# Altium schematic sheet bigsegment.SchDoc
size A3; SPICEModelCacheRLVYLVLF: <root> / <DocumentId>RLVYLVLF</DocumentId> / <CacheFrame Number="0"> / <Model Name="dtunnel1" Kind="CKT"> / <Text>*Tunnel Diode Default / *MCE 600V 50A 27.2ns default parameters / *Diode Pinout: A,K / * Parameters: / * RS:  Series resistance value / * RP:  Negative resistance value in parallel with capacitance. / * CP:   Capacitance value in parallel with negative resistance. / * LS:  Series inductance value. / * / * / .SUBCKT DTUNNEL1 1 2 PARAMS: Rs=6 Rp=-75 Cp=0.6E-12 Ls=0.1nH / RS  1 3  {Rs} / RP  3 4  {Rp} / CP  3 4  {Cp} / LS  4 2  {Ls} / .ENDS DTUNNEL1</Text> / </Model> / </CacheFrame> / </root>
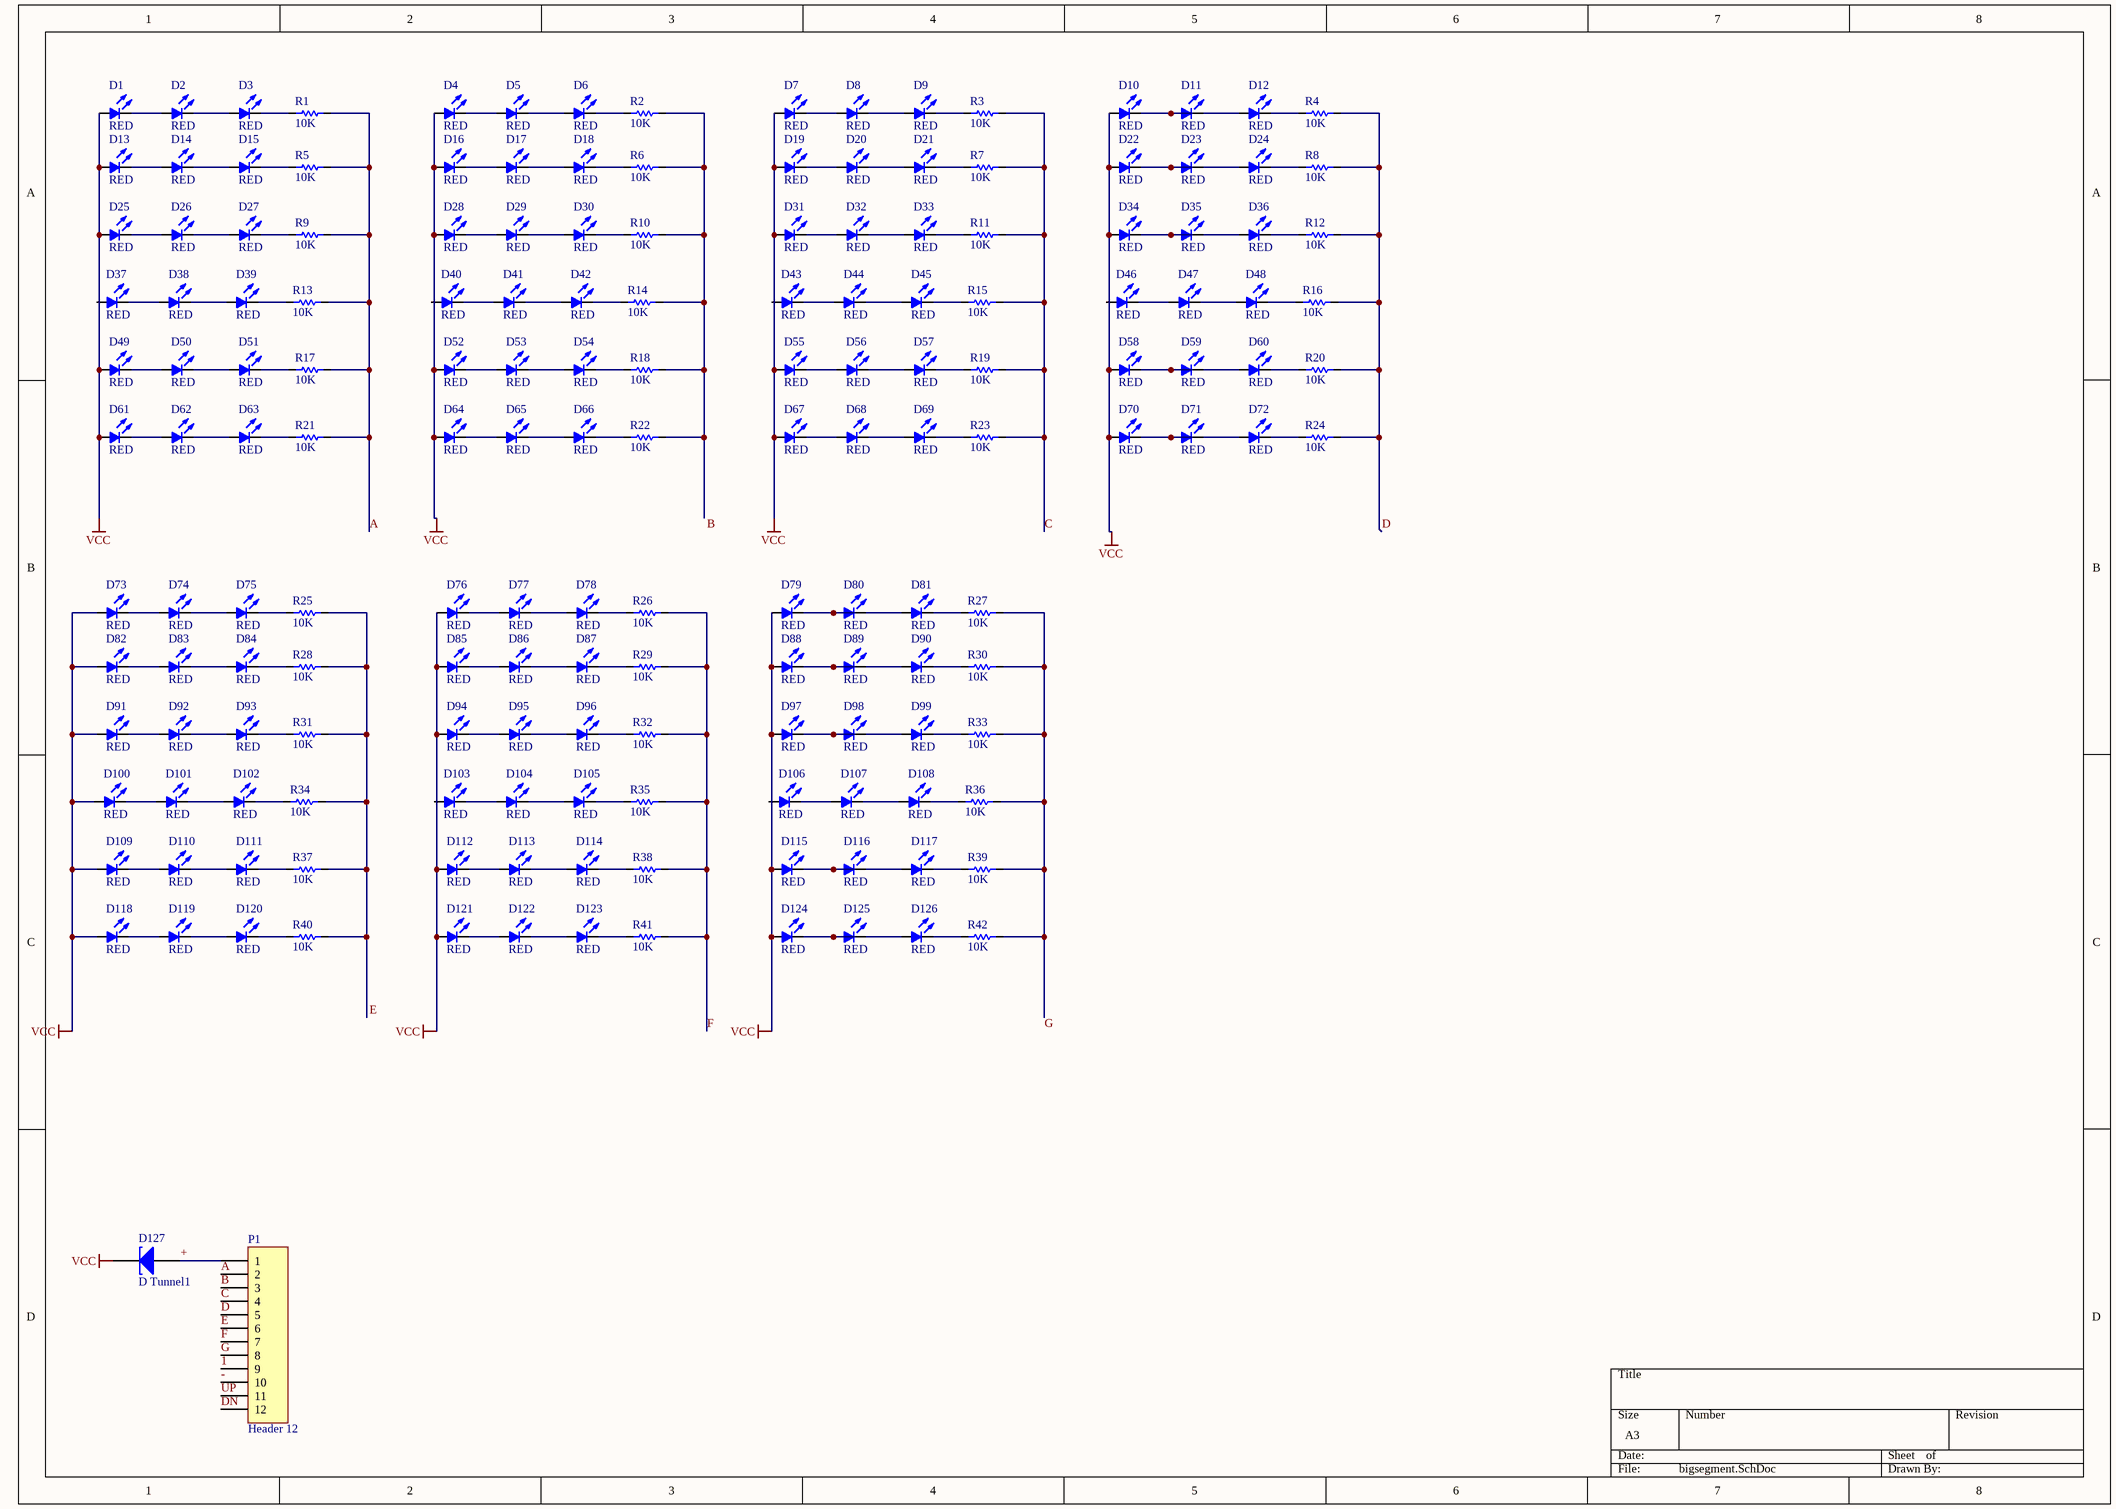
[diagram p0: bigsegment.SchDoc]

## Parts
D1  COLOR: RED  [RES 0805 (2012X06L)]  (hidden comment: MODEL)
D2  COLOR: RED  [RES 0805 (2012X06L)]  (hidden comment: MODEL)
D3  COLOR: RED  [RES 0805 (2012X06L)]  (hidden comment: MODEL)
D4  COLOR: RED  [RES 0805 (2012X06L)]  (hidden comment: MODEL)
D5  COLOR: RED  [RES 0805 (2012X06L)]  (hidden comment: MODEL)
D6  COLOR: RED  [RES 0805 (2012X06L)]  (hidden comment: MODEL)
D7  COLOR: RED  [RES 0805 (2012X06L)]  (hidden comment: MODEL)
D8  COLOR: RED  [RES 0805 (2012X06L)]  (hidden comment: MODEL)
D9  COLOR: RED  [RES 0805 (2012X06L)]  (hidden comment: MODEL)
D10  COLOR: RED  [RES 0805 (2012X06L)]  (hidden comment: MODEL)
D11  COLOR: RED  [RES 0805 (2012X06L)]  (hidden comment: MODEL)
D12  COLOR: RED  [RES 0805 (2012X06L)]  (hidden comment: MODEL)
D13  COLOR: RED  [RES 0805 (2012X06L)]  (hidden comment: MODEL)
D14  COLOR: RED  [RES 0805 (2012X06L)]  (hidden comment: MODEL)
D15  COLOR: RED  [RES 0805 (2012X06L)]  (hidden comment: MODEL)
D16  COLOR: RED  [RES 0805 (2012X06L)]  (hidden comment: MODEL)
D17  COLOR: RED  [RES 0805 (2012X06L)]  (hidden comment: MODEL)
D18  COLOR: RED  [RES 0805 (2012X06L)]  (hidden comment: MODEL)
D19  COLOR: RED  [RES 0805 (2012X06L)]  (hidden comment: MODEL)
D20  COLOR: RED  [RES 0805 (2012X06L)]  (hidden comment: MODEL)
D21  COLOR: RED  [RES 0805 (2012X06L)]  (hidden comment: MODEL)
D22  COLOR: RED  [RES 0805 (2012X06L)]  (hidden comment: MODEL)
D23  COLOR: RED  [RES 0805 (2012X06L)]  (hidden comment: MODEL)
D24  COLOR: RED  [RES 0805 (2012X06L)]  (hidden comment: MODEL)
D25  COLOR: RED  [RES 0805 (2012X06L)]  (hidden comment: MODEL)
D26  COLOR: RED  [RES 0805 (2012X06L)]  (hidden comment: MODEL)
D27  COLOR: RED  [RES 0805 (2012X06L)]  (hidden comment: MODEL)
D28  COLOR: RED  [RES 0805 (2012X06L)]  (hidden comment: MODEL)
D29  COLOR: RED  [RES 0805 (2012X06L)]  (hidden comment: MODEL)
D30  COLOR: RED  [RES 0805 (2012X06L)]  (hidden comment: MODEL)
D31  COLOR: RED  [RES 0805 (2012X06L)]  (hidden comment: MODEL)
D32  COLOR: RED  [RES 0805 (2012X06L)]  (hidden comment: MODEL)
D33  COLOR: RED  [RES 0805 (2012X06L)]  (hidden comment: MODEL)
D34  COLOR: RED  [RES 0805 (2012X06L)]  (hidden comment: MODEL)
D35  COLOR: RED  [RES 0805 (2012X06L)]  (hidden comment: MODEL)
D36  COLOR: RED  [RES 0805 (2012X06L)]  (hidden comment: MODEL)
D37  COLOR: RED  [RES 0805 (2012X06L)]  (hidden comment: MODEL)
D38  COLOR: RED  [RES 0805 (2012X06L)]  (hidden comment: MODEL)
D39  COLOR: RED  [RES 0805 (2012X06L)]  (hidden comment: MODEL)
D40  COLOR: RED  [RES 0805 (2012X06L)]  (hidden comment: MODEL)
D41  COLOR: RED  [RES 0805 (2012X06L)]  (hidden comment: MODEL)
D42  COLOR: RED  [RES 0805 (2012X06L)]  (hidden comment: MODEL)
D43  COLOR: RED  [RES 0805 (2012X06L)]  (hidden comment: MODEL)
D44  COLOR: RED  [RES 0805 (2012X06L)]  (hidden comment: MODEL)
D45  COLOR: RED  [RES 0805 (2012X06L)]  (hidden comment: MODEL)
D46  COLOR: RED  [RES 0805 (2012X06L)]  (hidden comment: MODEL)
D47  COLOR: RED  [RES 0805 (2012X06L)]  (hidden comment: MODEL)
D48  COLOR: RED  [RES 0805 (2012X06L)]  (hidden comment: MODEL)
D49  COLOR: RED  [RES 0805 (2012X06L)]  (hidden comment: MODEL)
D50  COLOR: RED  [RES 0805 (2012X06L)]  (hidden comment: MODEL)
D51  COLOR: RED  [RES 0805 (2012X06L)]  (hidden comment: MODEL)
D52  COLOR: RED  [RES 0805 (2012X06L)]  (hidden comment: MODEL)
D53  COLOR: RED  [RES 0805 (2012X06L)]  (hidden comment: MODEL)
D54  COLOR: RED  [RES 0805 (2012X06L)]  (hidden comment: MODEL)
D55  COLOR: RED  [RES 0805 (2012X06L)]  (hidden comment: MODEL)
D56  COLOR: RED  [RES 0805 (2012X06L)]  (hidden comment: MODEL)
D57  COLOR: RED  [RES 0805 (2012X06L)]  (hidden comment: MODEL)
D58  COLOR: RED  [RES 0805 (2012X06L)]  (hidden comment: MODEL)
D59  COLOR: RED  [RES 0805 (2012X06L)]  (hidden comment: MODEL)
D60  COLOR: RED  [RES 0805 (2012X06L)]  (hidden comment: MODEL)
D61  COLOR: RED  [RES 0805 (2012X06L)]  (hidden comment: MODEL)
D62  COLOR: RED  [RES 0805 (2012X06L)]  (hidden comment: MODEL)
D63  COLOR: RED  [RES 0805 (2012X06L)]  (hidden comment: MODEL)
D64  COLOR: RED  [RES 0805 (2012X06L)]  (hidden comment: MODEL)
D65  COLOR: RED  [RES 0805 (2012X06L)]  (hidden comment: MODEL)
D66  COLOR: RED  [RES 0805 (2012X06L)]  (hidden comment: MODEL)
D67  COLOR: RED  [RES 0805 (2012X06L)]  (hidden comment: MODEL)
D68  COLOR: RED  [RES 0805 (2012X06L)]  (hidden comment: MODEL)
D69  COLOR: RED  [RES 0805 (2012X06L)]  (hidden comment: MODEL)
D70  COLOR: RED  [RES 0805 (2012X06L)]  (hidden comment: MODEL)
D71  COLOR: RED  [RES 0805 (2012X06L)]  (hidden comment: MODEL)
D72  COLOR: RED  [RES 0805 (2012X06L)]  (hidden comment: MODEL)
D73  COLOR: RED  [RES 0805 (2012X06L)]  (hidden comment: MODEL)
D74  COLOR: RED  [RES 0805 (2012X06L)]  (hidden comment: MODEL)
D75  COLOR: RED  [RES 0805 (2012X06L)]  (hidden comment: MODEL)
D76  COLOR: RED  [RES 0805 (2012X06L)]  (hidden comment: MODEL)
D77  COLOR: RED  [RES 0805 (2012X06L)]  (hidden comment: MODEL)
D78  COLOR: RED  [RES 0805 (2012X06L)]  (hidden comment: MODEL)
D79  COLOR: RED  [RES 0805 (2012X06L)]  (hidden comment: MODEL)
D80  COLOR: RED  [RES 0805 (2012X06L)]  (hidden comment: MODEL)
D81  COLOR: RED  [RES 0805 (2012X06L)]  (hidden comment: MODEL)
D82  COLOR: RED  [RES 0805 (2012X06L)]  (hidden comment: MODEL)
D83  COLOR: RED  [RES 0805 (2012X06L)]  (hidden comment: MODEL)
D84  COLOR: RED  [RES 0805 (2012X06L)]  (hidden comment: MODEL)
D85  COLOR: RED  [RES 0805 (2012X06L)]  (hidden comment: MODEL)
D86  COLOR: RED  [RES 0805 (2012X06L)]  (hidden comment: MODEL)
D87  COLOR: RED  [RES 0805 (2012X06L)]  (hidden comment: MODEL)
D88  COLOR: RED  [RES 0805 (2012X06L)]  (hidden comment: MODEL)
D89  COLOR: RED  [RES 0805 (2012X06L)]  (hidden comment: MODEL)
D90  COLOR: RED  [RES 0805 (2012X06L)]  (hidden comment: MODEL)
D91  COLOR: RED  [RES 0805 (2012X06L)]  (hidden comment: MODEL)
D92  COLOR: RED  [RES 0805 (2012X06L)]  (hidden comment: MODEL)
D93  COLOR: RED  [RES 0805 (2012X06L)]  (hidden comment: MODEL)
D94  COLOR: RED  [RES 0805 (2012X06L)]  (hidden comment: MODEL)
D95  COLOR: RED  [RES 0805 (2012X06L)]  (hidden comment: MODEL)
D96  COLOR: RED  [RES 0805 (2012X06L)]  (hidden comment: MODEL)
D97  COLOR: RED  [RES 0805 (2012X06L)]  (hidden comment: MODEL)
D98  COLOR: RED  [RES 0805 (2012X06L)]  (hidden comment: MODEL)
D99  COLOR: RED  [RES 0805 (2012X06L)]  (hidden comment: MODEL)
D100  COLOR: RED  [RES 0805 (2012X06L)]  (hidden comment: MODEL)
D101  COLOR: RED  [RES 0805 (2012X06L)]  (hidden comment: MODEL)
D102  COLOR: RED  [RES 0805 (2012X06L)]  (hidden comment: MODEL)
D103  COLOR: RED  [RES 0805 (2012X06L)]  (hidden comment: MODEL)
D104  COLOR: RED  [RES 0805 (2012X06L)]  (hidden comment: MODEL)
D105  COLOR: RED  [RES 0805 (2012X06L)]  (hidden comment: MODEL)
D106  COLOR: RED  [RES 0805 (2012X06L)]  (hidden comment: MODEL)
D107  COLOR: RED  [RES 0805 (2012X06L)]  (hidden comment: MODEL)
D108  COLOR: RED  [RES 0805 (2012X06L)]  (hidden comment: MODEL)
D109  COLOR: RED  [RES 0805 (2012X06L)]  (hidden comment: MODEL)
D110  COLOR: RED  [RES 0805 (2012X06L)]  (hidden comment: MODEL)
D111  COLOR: RED  [RES 0805 (2012X06L)]  (hidden comment: MODEL)
D112  COLOR: RED  [RES 0805 (2012X06L)]  (hidden comment: MODEL)
D113  COLOR: RED  [RES 0805 (2012X06L)]  (hidden comment: MODEL)
D114  COLOR: RED  [RES 0805 (2012X06L)]  (hidden comment: MODEL)
D115  COLOR: RED  [RES 0805 (2012X06L)]  (hidden comment: MODEL)
D116  COLOR: RED  [RES 0805 (2012X06L)]  (hidden comment: MODEL)
D117  COLOR: RED  [RES 0805 (2012X06L)]  (hidden comment: MODEL)
D118  COLOR: RED  [RES 0805 (2012X06L)]  (hidden comment: MODEL)
D119  COLOR: RED  [RES 0805 (2012X06L)]  (hidden comment: MODEL)
D120  COLOR: RED  [RES 0805 (2012X06L)]  (hidden comment: MODEL)
D121  COLOR: RED  [RES 0805 (2012X06L)]  (hidden comment: MODEL)
D122  COLOR: RED  [RES 0805 (2012X06L)]  (hidden comment: MODEL)
D123  COLOR: RED  [RES 0805 (2012X06L)]  (hidden comment: MODEL)
D124  COLOR: RED  [RES 0805 (2012X06L)]  (hidden comment: MODEL)
D125  COLOR: RED  [RES 0805 (2012X06L)]  (hidden comment: MODEL)
D126  COLOR: RED  [RES 0805 (2012X06L)]  (hidden comment: MODEL)
D127  D Tunnel1  [3.2X1.6X1.1]
P1  Header 12  [HDR1X12]
R1  10K  [RES 1206 (3216X08L)]
R2  10K  [RES 1206 (3216X08L)]
R3  10K  [RES 1206 (3216X08L)]
R4  10K  [RES 1206 (3216X08L)]
R5  10K  [RES 1206 (3216X08L)]
R6  10K  [RES 1206 (3216X08L)]
R7  10K  [RES 1206 (3216X08L)]
R8  10K  [RES 1206 (3216X08L)]
R9  10K  [RES 1206 (3216X08L)]
R10  10K  [RES 1206 (3216X08L)]
R11  10K  [RES 1206 (3216X08L)]
R12  10K  [RES 1206 (3216X08L)]
R13  10K  [RES 1206 (3216X08L)]
R14  10K  [RES 1206 (3216X08L)]
R15  10K  [RES 1206 (3216X08L)]
R16  10K  [RES 1206 (3216X08L)]
R17  10K  [RES 1206 (3216X08L)]
R18  10K  [RES 1206 (3216X08L)]
R19  10K  [RES 1206 (3216X08L)]
R20  10K  [RES 1206 (3216X08L)]
R21  10K  [RES 1206 (3216X08L)]
R22  10K  [RES 1206 (3216X08L)]
R23  10K  [RES 1206 (3216X08L)]
R24  10K  [RES 1206 (3216X08L)]
R25  10K  [RES 1206 (3216X08L)]
R26  10K  [RES 1206 (3216X08L)]
R27  10K  [RES 1206 (3216X08L)]
R28  10K  [RES 1206 (3216X08L)]
R29  10K  [RES 1206 (3216X08L)]
R30  10K  [RES 1206 (3216X08L)]
R31  10K  [RES 1206 (3216X08L)]
R32  10K  [RES 1206 (3216X08L)]
R33  10K  [RES 1206 (3216X08L)]
R34  10K  [RES 1206 (3216X08L)]
R35  10K  [RES 1206 (3216X08L)]
R36  10K  [RES 1206 (3216X08L)]
R37  10K  [RES 1206 (3216X08L)]
R38  10K  [RES 1206 (3216X08L)]
R39  10K  [RES 1206 (3216X08L)]
R40  10K  [RES 1206 (3216X08L)]
R41  10K  [RES 1206 (3216X08L)]
R42  10K  [RES 1206 (3216X08L)]

## Nets
VCC: D1.1(A) D4.1(A) D7.1(A) D10.1(A) D13.1(A) D16.1(A) D19.1(A) D22.1(A) D25.1(A) D28.1(A) D31.1(A) D34.1(A) D49.1(A) D52.1(A) D55.1(A) D58.1(A) D61.1(A) D64.1(A) D67.1(A) D70.1(A) D73.1(A) D76.1(A) D79.1(A) D82.1(A) D85.1(A) D88.1(A) D91.1(A) D94.1(A) D97.1(A) D100.1(A) D109.1(A) D112.1(A) D115.1(A) D118.1(A) D121.1(A) D124.1(A) D127.2(K)
1: P1.9
+: D127.1(A) P1.1
-: P1.10
A: P1.2 R1.1 R5.1 R9.1 R13.1 R17.1 R21.1
B: P1.3
C: P1.4 R3.1 R7.1 R11.1 R15.1 R19.1 R23.1
D: P1.5 R4.1 R8.1 R12.1 R16.1 R20.1 R24.1
DN: P1.12
E: P1.6
F: P1.7 R26.1 R29.1 R32.1 R35.1 R38.1 R41.1
G: P1.8
UP: P1.11
NetD1_2: D1.2(K) D2.1(A)
NetD2_2: D2.2(K) D3.1(A)
NetD3_2: D3.2(K) R1.2
NetD4_2: D4.2(K) D5.1(A)
NetD5_2: D5.2(K) D6.1(A)
NetD6_2: D6.2(K) R2.2
NetD7_2: D7.2(K) D8.1(A)
NetD8_2: D8.2(K) D9.1(A)
NetD9_2: D9.2(K) R3.2
NetD10_2: D10.2(K) D11.1(A)
NetD11_2: D11.2(K) D12.1(A)
NetD12_2: D12.2(K) R4.2
NetD13_2: D13.2(K) D14.1(A)
NetD14_2: D14.2(K) D15.1(A)
NetD15_2: D15.2(K) R5.2
NetD16_2: D16.2(K) D17.1(A)
NetD17_2: D17.2(K) D18.1(A)
NetD18_2: D18.2(K) R6.2
NetD19_2: D19.2(K) D20.1(A)
NetD20_2: D20.2(K) D21.1(A)
NetD21_2: D21.2(K) R7.2
NetD22_2: D22.2(K) D23.1(A)
NetD23_2: D23.2(K) D24.1(A)
NetD24_2: D24.2(K) R8.2
NetD25_2: D25.2(K) D26.1(A)
NetD26_2: D26.2(K) D27.1(A)
NetD27_2: D27.2(K) R9.2
NetD28_2: D28.2(K) D29.1(A)
NetD29_2: D29.2(K) D30.1(A)
NetD30_2: D30.2(K) R10.2
NetD31_2: D31.2(K) D32.1(A)
NetD32_2: D32.2(K) D33.1(A)
NetD33_2: D33.2(K) R11.2
NetD34_2: D34.2(K) D35.1(A)
NetD35_2: D35.2(K) D36.1(A)
NetD36_2: D36.2(K) R12.2
NetD37_2: D37.2(K) D38.1(A)
NetD38_2: D38.2(K) D39.1(A)
NetD39_2: D39.2(K) R13.2
NetD40_2: D40.2(K) D41.1(A)
NetD41_2: D41.2(K) D42.1(A)
NetD42_2: D42.2(K) R14.2
NetD43_2: D43.2(K) D44.1(A)
NetD44_2: D44.2(K) D45.1(A)
NetD45_2: D45.2(K) R15.2
NetD46_2: D46.2(K) D47.1(A)
NetD47_2: D47.2(K) D48.1(A)
NetD48_2: D48.2(K) R16.2
NetD49_2: D49.2(K) D50.1(A)
NetD50_2: D50.2(K) D51.1(A)
NetD51_2: D51.2(K) R17.2
NetD52_2: D52.2(K) D53.1(A)
NetD53_2: D53.2(K) D54.1(A)
NetD54_2: D54.2(K) R18.2
NetD55_2: D55.2(K) D56.1(A)
NetD56_2: D56.2(K) D57.1(A)
NetD57_2: D57.2(K) R19.2
NetD58_2: D58.2(K) D59.1(A)
NetD59_2: D59.2(K) D60.1(A)
NetD60_2: D60.2(K) R20.2
NetD61_2: D61.2(K) D62.1(A)
NetD62_2: D62.2(K) D63.1(A)
NetD63_2: D63.2(K) R21.2
NetD64_2: D64.2(K) D65.1(A)
NetD65_2: D65.2(K) D66.1(A)
NetD66_2: D66.2(K) R22.2
NetD67_2: D67.2(K) D68.1(A)
NetD68_2: D68.2(K) D69.1(A)
NetD69_2: D69.2(K) R23.2
NetD70_2: D70.2(K) D71.1(A)
NetD71_2: D71.2(K) D72.1(A)
NetD72_2: D72.2(K) R24.2
NetD73_2: D73.2(K) D74.1(A)
NetD74_2: D74.2(K) D75.1(A)
NetD75_2: D75.2(K) R25.2
NetD76_2: D76.2(K) D77.1(A)
NetD77_2: D77.2(K) D78.1(A)
NetD78_2: D78.2(K) R26.2
NetD79_2: D79.2(K) D80.1(A)
NetD80_2: D80.2(K) D81.1(A)
NetD81_2: D81.2(K) R27.2
NetD82_2: D82.2(K) D83.1(A)
NetD83_2: D83.2(K) D84.1(A)
NetD84_2: D84.2(K) R28.2
NetD85_2: D85.2(K) D86.1(A)
NetD86_2: D86.2(K) D87.1(A)
NetD87_2: D87.2(K) R29.2
NetD88_2: D88.2(K) D89.1(A)
NetD89_2: D89.2(K) D90.1(A)
NetD90_2: D90.2(K) R30.2
NetD91_2: D91.2(K) D92.1(A)
NetD92_2: D92.2(K) D93.1(A)
NetD93_2: D93.2(K) R31.2
NetD94_2: D94.2(K) D95.1(A)
NetD95_2: D95.2(K) D96.1(A)
NetD96_2: D96.2(K) R32.2
NetD97_2: D97.2(K) D98.1(A)
NetD98_2: D98.2(K) D99.1(A)
NetD99_2: D99.2(K) R33.2
NetD100_2: D100.2(K) D101.1(A)
NetD101_2: D101.2(K) D102.1(A)
NetD102_2: D102.2(K) R34.2
NetD103_2: D103.2(K) D104.1(A)
NetD104_2: D104.2(K) D105.1(A)
NetD105_2: D105.2(K) R35.2
NetD106_2: D106.2(K) D107.1(A)
NetD107_2: D107.2(K) D108.1(A)
NetD108_2: D108.2(K) R36.2
NetD109_2: D109.2(K) D110.1(A)
NetD110_2: D110.2(K) D111.1(A)
NetD111_2: D111.2(K) R37.2
NetD112_2: D112.2(K) D113.1(A)
NetD113_2: D113.2(K) D114.1(A)
NetD114_2: D114.2(K) R38.2
NetD115_2: D115.2(K) D116.1(A)
NetD116_2: D116.2(K) D117.1(A)
NetD117_2: D117.2(K) R39.2
NetD118_2: D118.2(K) D119.1(A)
NetD119_2: D119.2(K) D120.1(A)
NetD120_2: D120.2(K) R40.2
NetD121_2: D121.2(K) D122.1(A)
NetD122_2: D122.2(K) D123.1(A)
NetD123_2: D123.2(K) R41.2
NetD124_2: D124.2(K) D125.1(A)
NetD125_2: D125.2(K) D126.1(A)
NetD126_2: D126.2(K) R42.2
NetR2_1: R2.1 R6.1 R10.1 R14.1 R18.1 R22.1
NetR25_1: R25.1 R28.1 R31.1 R34.1 R37.1 R40.1
NetR27_1: R27.1 R30.1 R33.1 R36.1 R39.1 R42.1

Not connected (* = marked no-connect by the designer): D37 1(A); D40 1(A); D43 1(A); D46 1(A); D103 1(A); D106 1(A)

## Notes on the sheet
- Labels drawn without touching a wire or pin: B, E, G

## Library data of the parts
D1-D126 = LED 5mm: Typical LED
D127 = D Tunnel1: Tunnel Diode - RLC Model; Published: 8-Jun-2000; LatestRevisionDate: 17-Jul-2002; LatestRevisionNote: Re-released for DXP Platform.; PackageVersion: Feb-2002; PackageReference: 3.2X1.6X1.1; Publisher: Altium Limited; PackageDescription: SM LED; 2 Flat Leads
P1 = Header 12: Header, 12-Pin; LatestRevisionDate: 17-Jul-2002; LatestRevisionNote: Re-released for DXP Platform.; Publisher: Altium Limited
R1-R42 = Resistor: Tolerance: 5%; Power: 1/4 W; Value: 10K